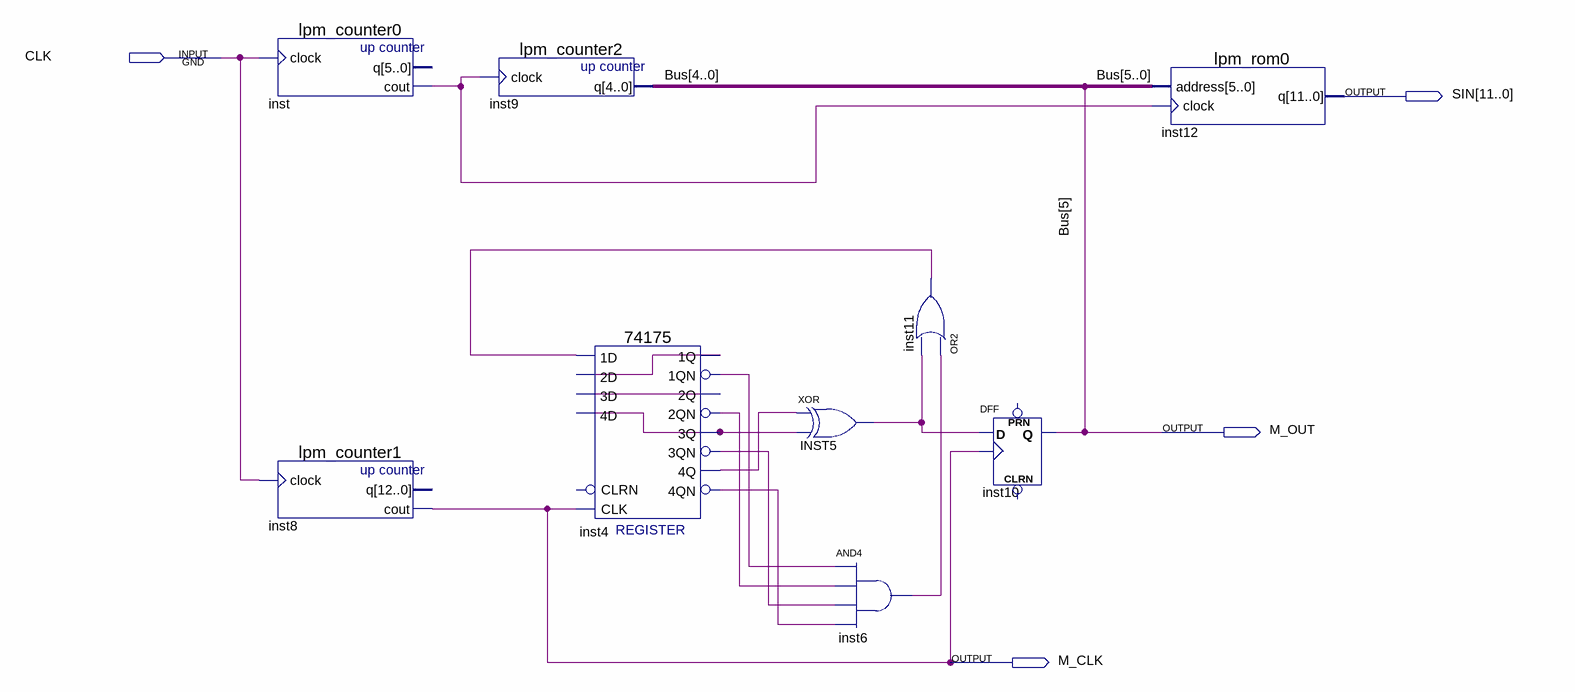
[diagram p0: schematic sheet]
// Quartus schematic abc.bdf as structural Verilog: 9 symbols, 4 pins
module abc (
  input  CLK,
  output [11:0] SIN,
  output M_OUT,
  output M_CLK
);

  wire inst4_1q, inst4_1qn, inst4_2q, inst4_2qn, inst4_3q, inst4_3qn, inst4_4q, inst4_4qn, INST5_out,
       inst6_out, inst11_out, inst_cout;
  wire [4:0] Bus;

  lpm_counter0 inst (.clock(CLK), .cout(inst_cout));  // open: q
  lpm_counter1 inst8 (.clock(CLK), .cout(M_CLK));  // open: q
  lpm_counter2 inst9 (.clock(inst_cout), .q(Bus));
  \74175  inst4 (
    .CLK(M_CLK), .\3D (inst4_2q), .\2D (inst4_1q), .\1D (inst11_out), .\4D (inst4_3q), .\1QN (inst4_1qn),
    .\1Q (inst4_1q), .\2QN (inst4_2qn), .\3Q (inst4_3q), .\2Q (inst4_2q), .\4QN (inst4_4qn), .\4Q (inst4_4q),
    .\3QN (inst4_3qn));  // open: CLRN
  xor INST5 (INST5_out, inst4_4q, inst4_3q);
  and inst6 (inst6_out, inst4_1qn, inst4_2qn, inst4_3qn, inst4_4qn);
  or inst11 (inst11_out, inst6_out, INST5_out);
  DFF inst10 (.CLK(M_CLK), .D(INST5_out), .Q(M_OUT));  // open: CLRN, PRN
  lpm_rom0 inst12 (.address({M_OUT, Bus}), .clock(inst_cout), .q(SIN));

  // Other names for the same wires on the sheet: Bus[5] = M_OUT
endmodule
